# Altium schematic sheet switches.SchDoc
size A4; SheetNumber: 3; SheetTotal: 6
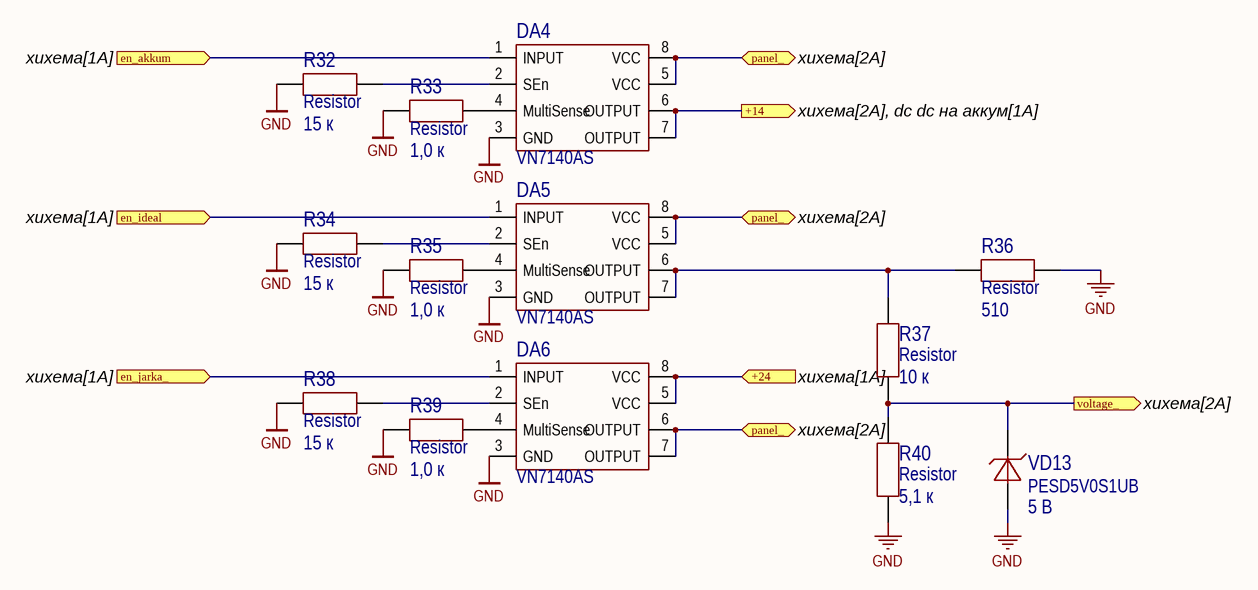
[diagram p0: switches.SchDoc]

## Parts
DA4  VN7140AS  [SOP8]
DA5  VN7140AS  [SOP8]
DA6  VN7140AS  [SOP8]
R32  Resistor  value 15 к  [0603R]
R33  Resistor  value 1,0 к  [0603R]
R34  Resistor  value 15 к  [0603R]
R35  Resistor  value 1,0 к  [0603R]
R36  Resistor  value 510  [2512R]
R37  Resistor  value 10 к  [0603R]
R38  Resistor  value 15 к  [0603R]
R39  Resistor  value 1,0 к  [0603R]
R40  Resistor  value 5,1 к  [0603R]
VD13  PESD5V0S1UB  value 5 В  [SOD523]

## Ports
+14 (out, see хихема[2A], dc dc на аккум[1A]), +24 (in, see хихема[1A]), en_akkum (in, see хихема[1A]), en_ideal (in, see хихема[1A]), en_jarka_ (in, see хихема[1A]), panel_ (bidir, see хихема[2A]), voltage_ (out, see хихема[2A])

## Nets
GND: DA4.3(GND) DA5.3(GND) DA6.3(GND) R32.1 R33.1 R34.1 R35.1 R36.2 R38.1 R39.1 R40.1 VD13.1
+14: DA4.6(OUTPUT) DA4.7(OUTPUT) ; port +14
+24: DA6.5(VCC) DA6.8(VCC) ; port +24
en_akkum: DA4.1(INPUT) ; port en_akkum
en_ideal: DA5.1(INPUT) ; port en_ideal
en_jarka_: DA6.1(INPUT) ; port en_jarka_
panel_: DA4.5(VCC) DA4.8(VCC) DA5.5(VCC) DA5.8(VCC) DA6.6(OUTPUT) DA6.7(OUTPUT) ; port panel_
voltage_: R37.1 R40.2 VD13.2 ; port voltage_
NetDA4_2: DA4.2(SEn) R32.2
NetDA4_4: DA4.4(MultiSense) R33.2
NetDA5_2: DA5.2(SEn) R34.2
NetDA5_4: DA5.4(MultiSense) R35.2
NetDA5_6: DA5.6(OUTPUT) DA5.7(OUTPUT) R36.1 R37.2
NetDA6_2: DA6.2(SEn) R38.2
NetDA6_4: DA6.4(MultiSense) R39.2

## Library data of the parts
DA4-DA6 = VN7140AS: Силовой ключ верхнего плеча с аналоговой обратной связью MultiSense автомобильного применения; Part Number: VN7140AS
R32 R34 R38 = Resistor_15k_1_0603: Резистор номиналом 15 кОм и точностью 1%; Power: *; Part Number: Resistor_15k_1_0603; Tolerance: 1%
R33 R35 R39 = Resistor_1.0k_1_0603: Резистор номиналом 1,0 кОм и точностью 1%; Power: *; Part Number: Resistor_1.0k_1_0603; Tolerance: 1%
R36 = Resistor_510_1_0603: Резистор номиналом 510 Ом и точностью 1%; Power: *; Part Number: Resistor_510_1_0603; Tolerance: 1%
R37 = Resistor_10k_1_0603: Резистор номиналом 10 кОм и точностью 1%; Power: *; Part Number: Resistor_10k_1_0603; Tolerance: 1%
R40 = Resistor_5.1k_1_0603: Резистор номиналом 5,1 кОм и точностью 1%; Power: *; Part Number: Resistor_5.1k_1_0603; Tolerance: 1%
VD13 = PESD5V0S1UB: Защитный диод на 5 В, рассеиваемая мощность 330 Вт; Voltage nominal (V): 5; Power (W): 330; Part Number: PESD5V0S1UB